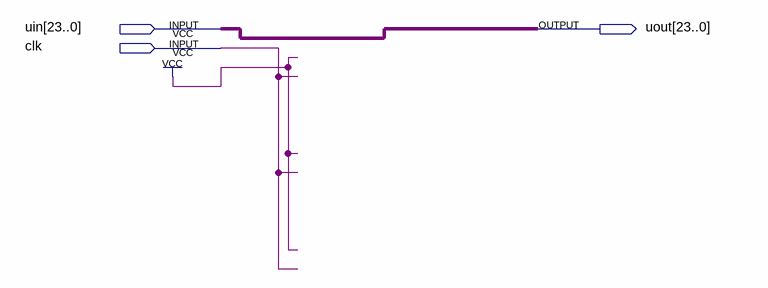
[diagram p0: schematic sheet]
// Quartus schematic uir.bdf as structural Verilog: 0 symbols, 3 pins
module uir (
  input  [23:0] uin,
  input  clk,
  output [23:0] uout
);


  assign uout = uin;
endmodule
